# Altium schematic sheet psu.schdoc
size A4
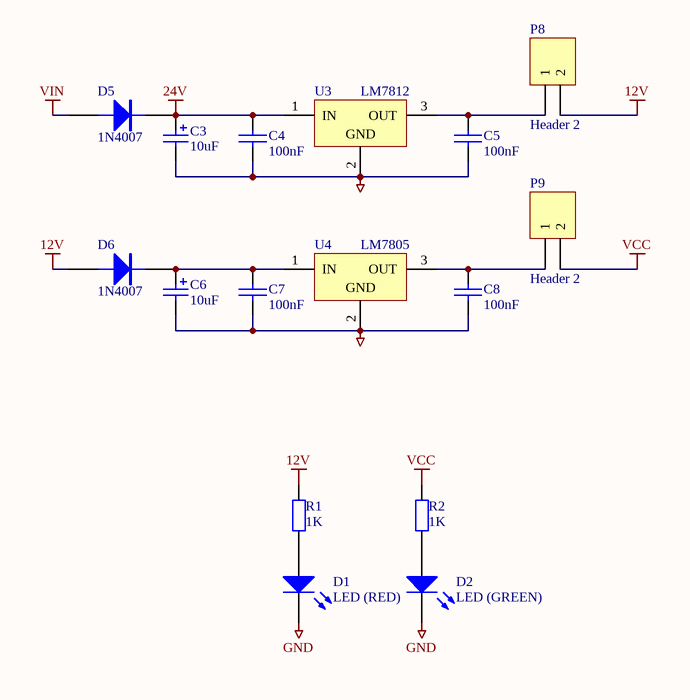
[diagram p0: psu.schdoc]

## Parts
C3  10uF  [RB7.6-15]
C4  100nF  [CAP RADIAL 0.200]
C5  100nF  [CAP RADIAL 0.200]
C6  10uF  [RB7.6-15]
C7  100nF  [CAP RADIAL 0.200]
C8  100nF  [CAP RADIAL 0.200]
D1  LED (RED)  [LED(3D) 5MM VERTICAL (GREEN)]
D2  LED (GREEN)  [LED(3D) 5MM VERTICAL (GREEN)]
D5  1N4007  [DO-35]
D6  1N4007  [DO-35]
P8  Header 2  [HDR1X2]
P9  Header 2  [HDR1X2]
R1  value 1K  [AXIAL-0.4]  (hidden comment: Res2)
R2  value 1K  [AXIAL-0.4]  (hidden comment: Res2)
U3  LM7812  [TO-220]
U4  LM7805  [TO-220]

## Nets
12V: D6.1(A) P8.2 R1.1
24V: C3.1 C4.1 D5.2(K) U3.1(IN)
GND: C3.2 C4.2 C5.2 C6.2 C7.2 C8.2 D1.2(K) D2.2(K) U3.2(GND) U4.2(GND)
VCC: P9.2 R2.1
VIN: D5.1(A)
NetC5_1: C5.1 P8.1 U3.3(OUT)
NetC6_1: C6.1 C7.1 D6.2(K) U4.1(IN)
NetC8_1: C8.1 P9.1 U4.3(OUT)
NetD1_1: D1.1(A) R1.2
NetD2_1: D2.1(A) R2.2

## Library data of the parts
C3 C6 = Cap Pol: CAPACITOR POLARISED TAG B CASE; Manufacturer: Vishay/Sprague; Manufacturer Part No.: 591D106X9020B2T15H; value: 10uF; Mouser Part no.: 71-591D106X9020B2T15; Web link: http://au.mouser.com/ProductDetail/Vishay-Sprague/591D106X9020B2T15H/?qs=sGAEpiMZZMuEN2agSAc2pvHIaWFtjSV0lDKOXo3DDxQ%3d
C4 C5 C7 C8 = CAP: CAPACITOR SMD 0603; Manufacturer: Murata; Manufacturer Part No.: GCM188R71C104KA37D; value: 100nF; Mouser Part no.: 81-GCM188R71C104KA7D; Web link: http://au.mouser.com/ProductDetail/Murata/GCM188R71C104KA37D/?qs=aEuGZpxfbxWKAxwYn%252beTMg%3d%3d
D1 D2 = LED 3mm RED: 3mm RED LED; Manufacturer: Kingbright; Manufacturer Part No.: WP132XIT; Mouser Part no.: 604-WP132XIT; Farnell Part no.: 1003393; Web link: http://au.mouser.com/Search/Refine.aspx?Keyword=604-WP132XIT
D5 D6 = DIODE: DIODE, POWER; Manufacturer: TAIWAN SEMI; Manufacturer Part No.: S1M; value: S1M; Mouser Part no.: 821-S1M; Web link: http://au.mouser.com/ProductDetail/Taiwan-Semiconductor/S1M/?qs=sGAEpiMZZMtEwUVCuofpuOlSmRjzJonf%252bmrIm0%252bGbjE%3d
P8 P9 = Header 2: Header, 2-Pin; LatestRevisionDate: 17-Jul-2002; LatestRevisionNote: Re-released for DXP Platform.; Publisher: Altium Limited
R1 R2 = Res2: Resistor; Published: 8-Jun-2000; LatestRevisionDate: 17-Jul-2002; LatestRevisionNote: Re-released for DXP Platform.; PackageReference: AXIAL-0.4; Publisher: Altium Limited; PackageDescription: Axial Device, Thru-Hole; 2 Leads; 0.4 in Pin Spacing
U3 = MC7805ACT: 3-Terminal Positive Fixed Voltage Regulator; Manufacturer: Fairchild Semiconductor; Value: LM7812; Manufacturer Part No.: LM7812; Web link: http://au.mouser.com/ProductDetail/Fairchild-Semiconductor/LM7805CT/?qs=sGAEpiMZZMtUqDgmOWBjgPJMQlYvsHAW%252bBbwCYnQla0%3d
U4 = MC7805ACT: 3-Terminal Positive Fixed Voltage Regulator; Manufacturer: Fairchild Semiconductor; Manufacturer Part No.: LM7805CT; Mouser Part No.: 512-LM7805CT; Value: LM7805; Web link: http://au.mouser.com/ProductDetail/Fairchild-Semiconductor/LM7805CT/?qs=sGAEpiMZZMtUqDgmOWBjgPJMQlYvsHAW%252bBbwCYnQla0%3d